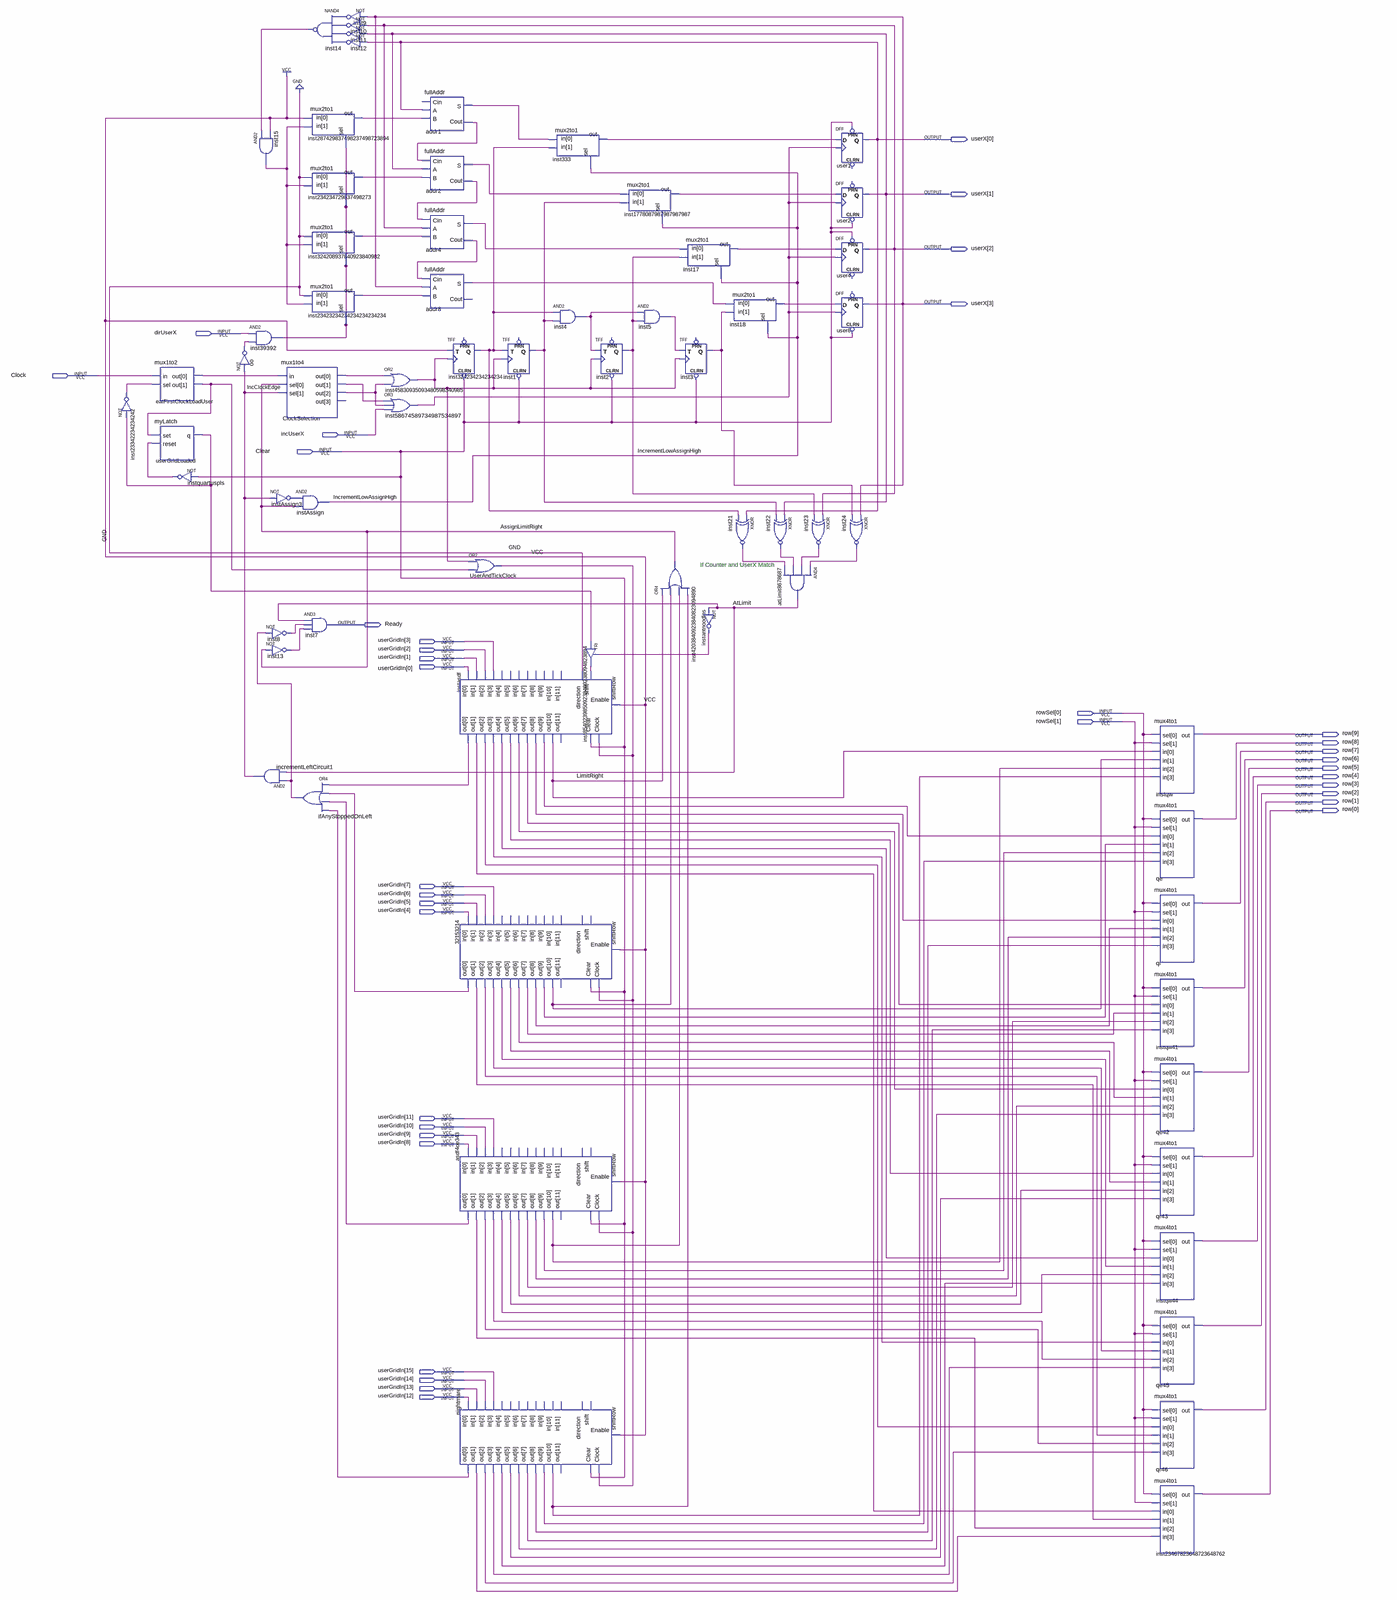
[diagram p0: schematic sheet, whole]
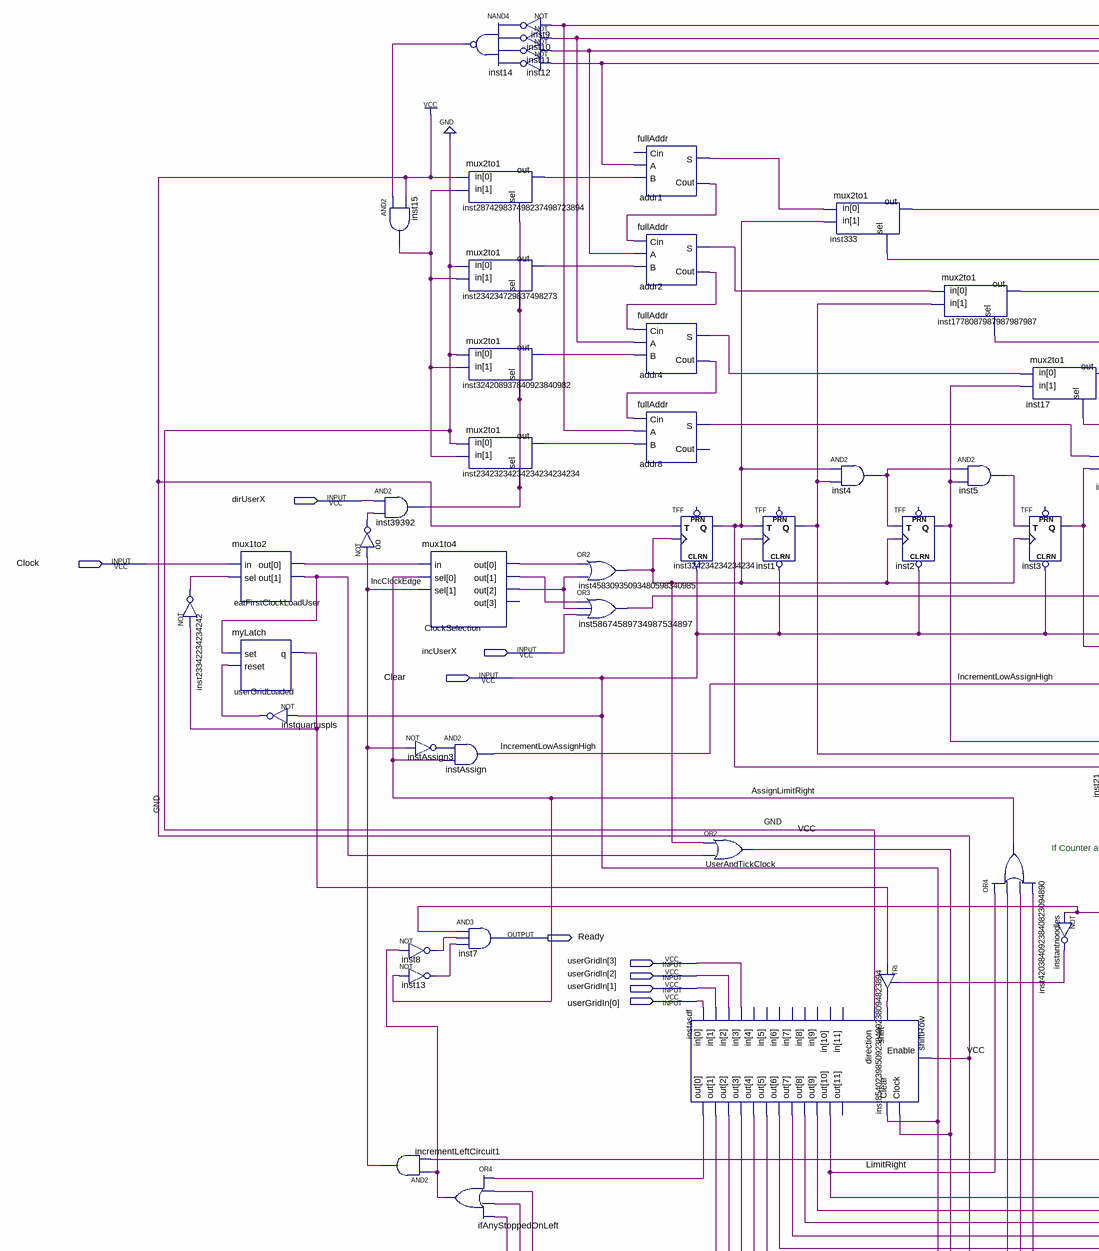
[diagram p1: schematic sheet, upper left part]
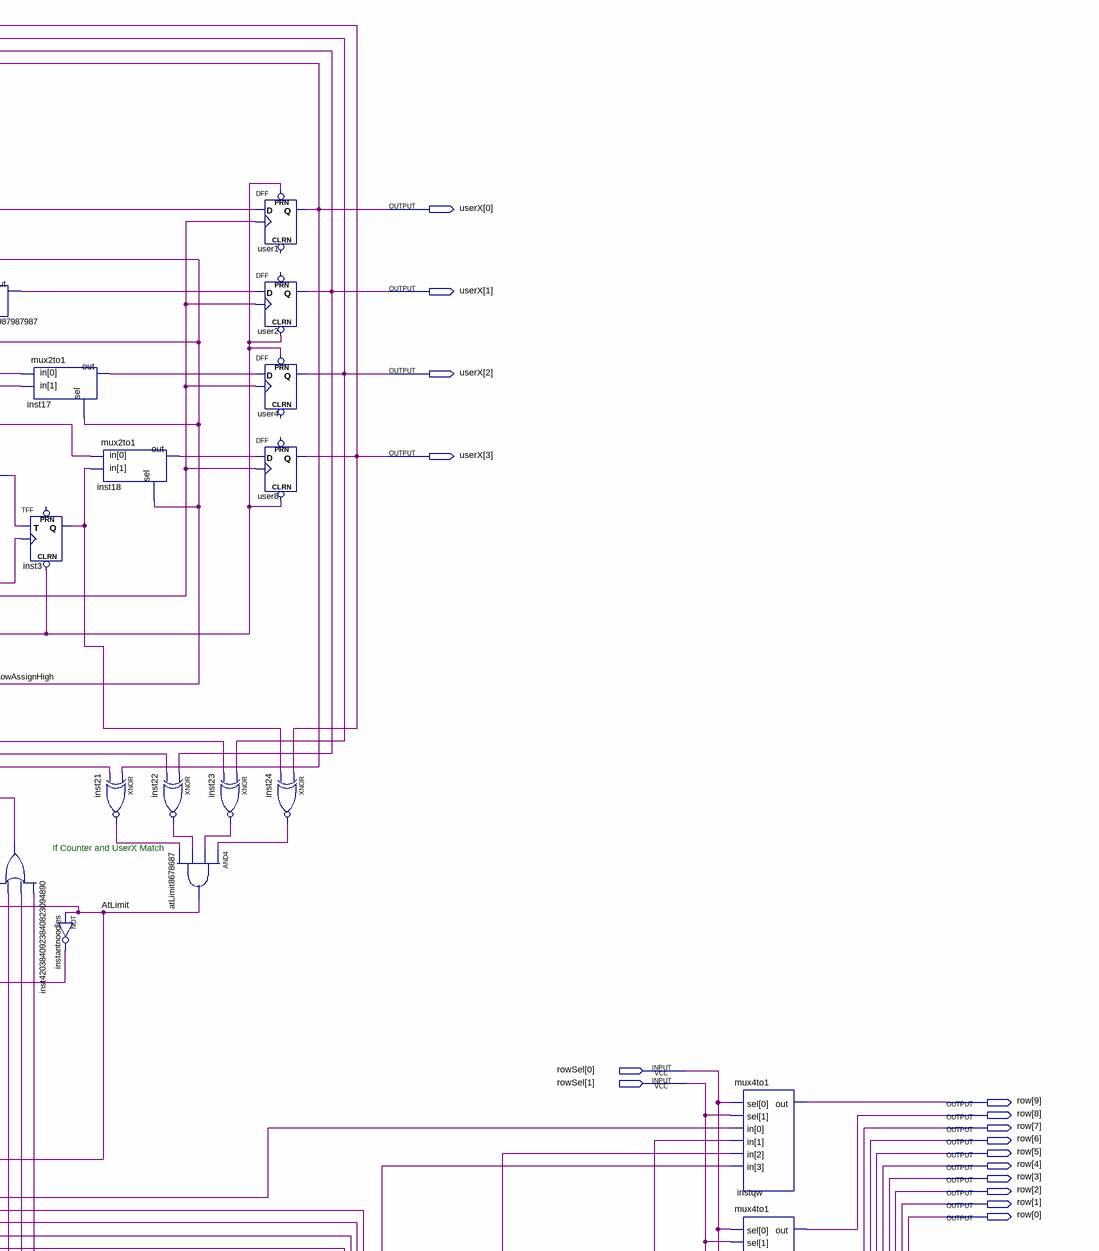
[diagram p2: schematic sheet, upper right part]
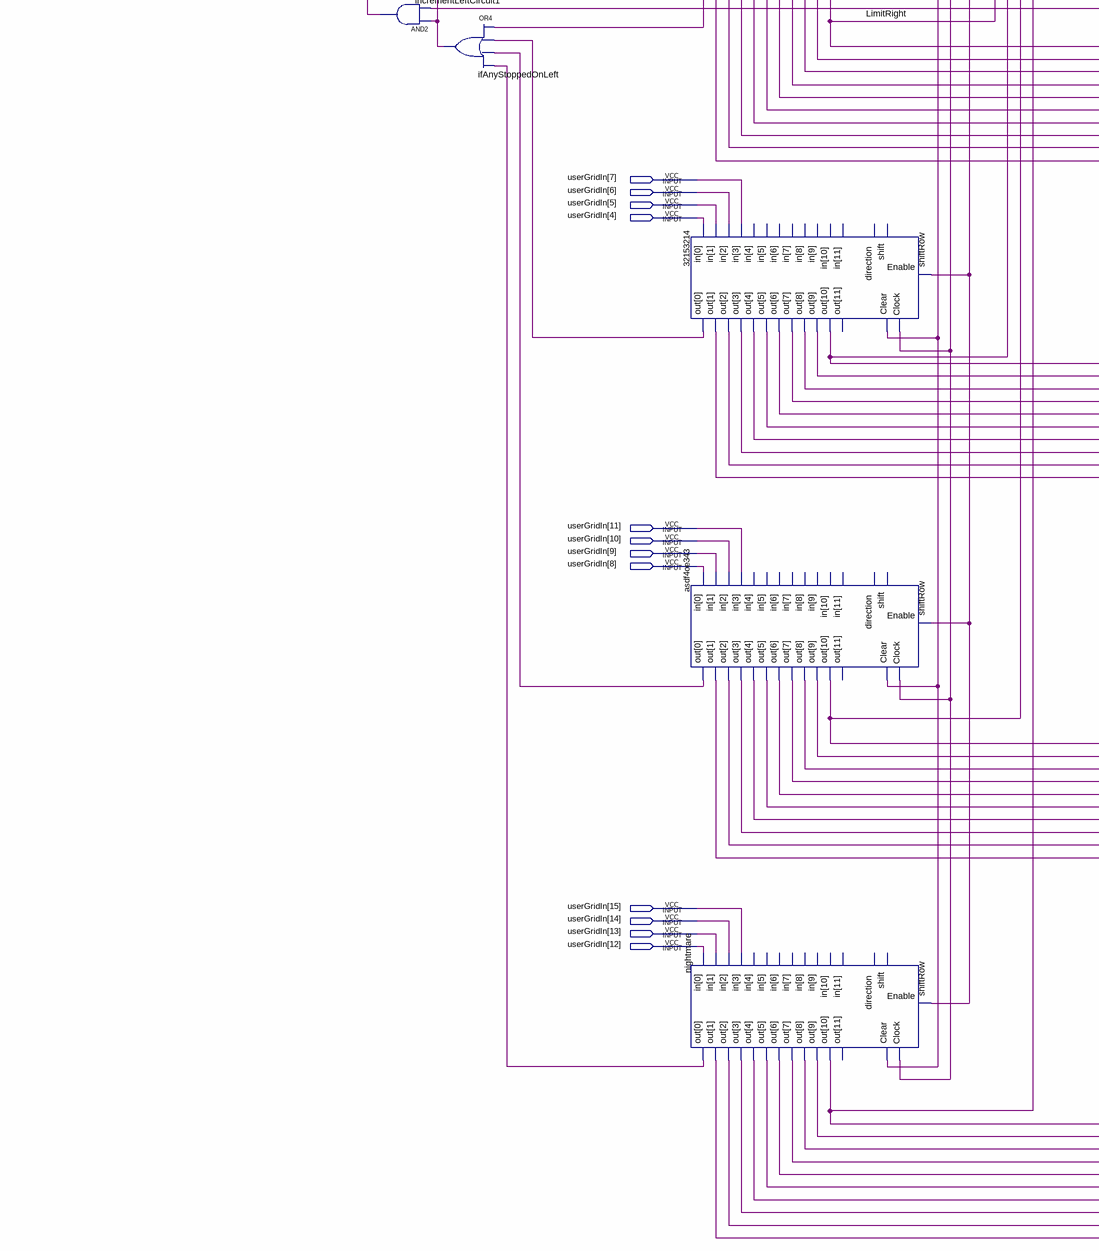
[diagram p3: schematic sheet, lower left part]
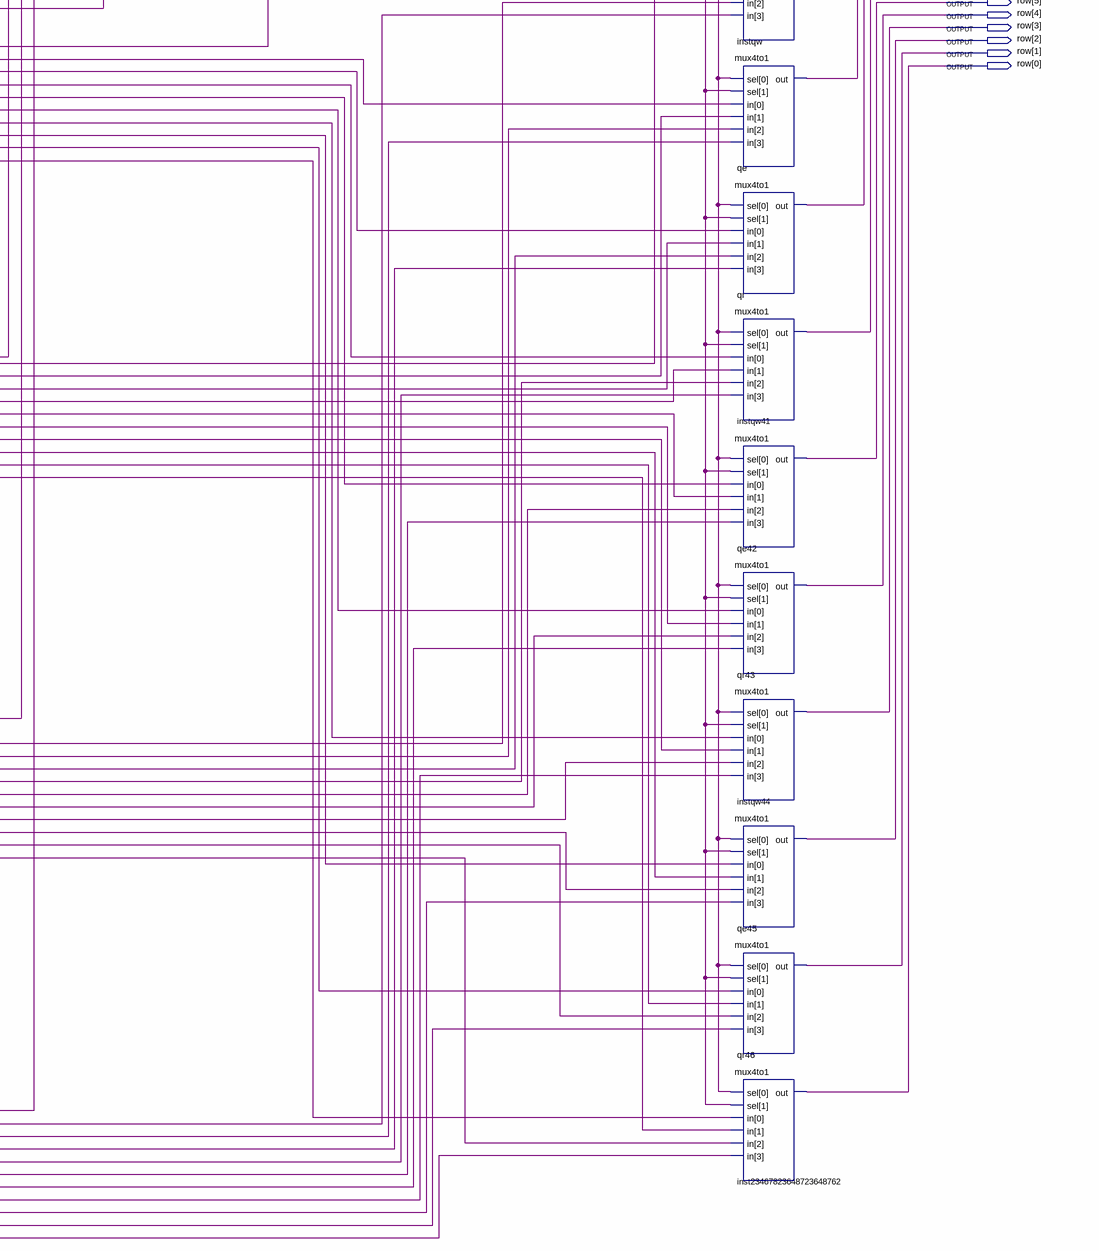
[diagram p4: schematic sheet, lower right part]
// Quartus schematic userX.bdf as structural Verilog: 67 symbols, 37 pins
module userX (
  input  dirUserX,
  input  Clock,
  input  incUserX,
  input  Clear,
  input  [15:0] userGridIn,
  input  [1:0] rowSel,
  output [3:0] userX,
  output Ready,
  output [9:0] row
);

  wire addr1_cout, addr1_s, addr2_cout, addr2_s, addr4_cout, addr4_s, addr8_s, asdf4oe343_out,
       asdf4oe343_out_2, asdf4oe343_out_3, asdf4oe343_out_4, asdf4oe343_out_5, asdf4oe343_out_6,
       asdf4oe343_out_7, asdf4oe343_out_8, asdf4oe343_out_9, asdf4oe343_out_10, asdf4oe343_out_11,
       AssignLimitRight, AtLimit, ClockSelection_out, ClockSelection_out_2, ClockSelection_out_3,
       eatFirstClockLoadUser_out, eatFirstClockLoadUser_out_2, ifAnyStoppedOnLeft_out, IncClockEdge,
       IncrementLowAssignHigh, inst1_q, inst2_q, inst3_q, inst4_out, inst5_out, inst8_out, inst9_out,
       inst10_out, inst11_out, inst12_out, inst13_out, inst14_out, inst15_out, inst17_out, inst18_out,
       inst21_out, inst22_out, inst23_out, inst24_out, inst333_out, inst39392_out, inst23342234234242_out,
       inst324234234234234_q, inst234234729837498273_out, inst1778087987987987987_out,
       inst58674589734987534897_out, inst324208937840923840982_out, inst23423234234234234234234_out,
       inst45830935093480598340985_out, inst287429837498237498723894_out,
       inst85402398509238409238094823894_out, instantnoodles_out, instasdf_out, instasdf_out_2,
       instasdf_out_3, instasdf_out_4, instasdf_out_5, instasdf_out_6, instasdf_out_7, instasdf_out_8,
       instasdf_out_9, instasdf_out_10, instAssign3_out, instquartuspls_out, LimitRight, n32153214_out,
       n32153214_out_2, n32153214_out_3, n32153214_out_4, n32153214_out_5, n32153214_out_6, n32153214_out_7,
       n32153214_out_8, n32153214_out_9, n32153214_out_10, n32153214_out_11, nightmare_out, nightmare_out_2,
       nightmare_out_3, nightmare_out_4, nightmare_out_5, nightmare_out_6, nightmare_out_7, nightmare_out_8,
       nightmare_out_9, nightmare_out_10, nightmare_out_11, oo_out, UserAndTickClock_out, userGridLoaded_q;
  wire [11:0] nightmare_out_open;  // unused outputs
  wire [11:0] asdf4oe343_out_open;  // unused outputs
  wire [11:0] u_32153214_out_open;  // unused outputs
  wire [11:0] instasdf_out_open;  // unused outputs
  wire [3:0] ClockSelection_out_open;  // unused outputs

  not inst23342234234242 (inst23342234234242_out, userGridLoaded_q);
  mux1to2 eatFirstClockLoadUser (
    .in(Clock), .sel(inst23342234234242_out), .out({eatFirstClockLoadUser_out, eatFirstClockLoadUser_out_2}));
  myLatch userGridLoaded (.set(eatFirstClockLoadUser_out), .reset(instquartuspls_out), .q(userGridLoaded_q));
  not instquartuspls (instquartuspls_out, Clear);
  not oo (oo_out, IncClockEdge);
  and inst15 (inst15_out, inst14_out, 1'b1);
  and inst39392 (inst39392_out, dirUserX, oo_out);
  mux1to4 ClockSelection (
    .in(eatFirstClockLoadUser_out_2), .sel({IncClockEdge, AssignLimitRight}),
    .out({ClockSelection_out_open[3], ClockSelection_out_3, ClockSelection_out, ClockSelection_out_2}));
  not instAssign3 (instAssign3_out, IncClockEdge);
  not inst8 (inst8_out, ifAnyStoppedOnLeft_out);
  not inst13 (inst13_out, AssignLimitRight);
  and incrementLeftCircuit1 (IncClockEdge, ifAnyStoppedOnLeft_out, AtLimit);
  nand inst14 (inst14_out, inst9_out, inst10_out, inst11_out, inst12_out);
  mux2to1 inst287429837498237498723894 (
    .in({inst15_out, 1'b1}), .sel(inst39392_out), .out(inst287429837498237498723894_out));
  mux2to1 inst234234729837498273 (.in({inst15_out, 1'b0}), .sel(inst39392_out), .out(inst234234729837498273_out));
  mux2to1 inst324208937840923840982 (.in({inst15_out, 1'b0}), .sel(inst39392_out), .out(inst324208937840923840982_out));
  mux2to1 inst23423234234234234234234 (
    .in({inst15_out, 1'b0}), .sel(inst39392_out), .out(inst23423234234234234234234_out));
  and instAssign (IncrementLowAssignHigh, instAssign3_out, AssignLimitRight);
  and inst7 (Ready, AtLimit, inst8_out, inst13_out);
  or ifAnyStoppedOnLeft (ifAnyStoppedOnLeft_out, instasdf_out_4, n32153214_out, asdf4oe343_out, nightmare_out);
  not inst9 (inst9_out, userX[3]);
  not inst10 (inst10_out, userX[2]);
  not inst11 (inst11_out, userX[1]);
  not inst12 (inst12_out, userX[0]);
  or inst45830935093480598340985 (inst45830935093480598340985_out, ClockSelection_out_2, ClockSelection_out_3);
  or inst58674589734987534897 (inst58674589734987534897_out, ClockSelection_out, ClockSelection_out_3, incUserX);
  fullAddr addr1 (.A(userX[0]), .B(inst287429837498237498723894_out), .Cout(addr1_cout), .S(addr1_s));  // open: Cin
  fullAddr addr2 (.A(userX[1]), .B(inst234234729837498273_out), .Cin(addr1_cout), .Cout(addr2_cout), .S(addr2_s));
  fullAddr addr4 (.A(userX[2]), .B(inst324208937840923840982_out), .Cin(addr2_cout), .Cout(addr4_cout), .S(addr4_s));
  fullAddr addr8 (.A(userX[3]), .B(inst23423234234234234234234_out), .Cin(addr4_cout), .S(addr8_s));  // open: Cout
  TFF inst324234234234234 (
    .CLRN(Clear), .T(1'b1), .CLK(inst45830935093480598340985_out), .Q(inst324234234234234_q));  // open: PRN
  or UserAndTickClock (UserAndTickClock_out, inst45830935093480598340985_out, eatFirstClockLoadUser_out);
  shiftRow instasdf (
    .in({{8{1'bz}}, userGridIn[3:0]}), .Enable(1'b1), .Clock(UserAndTickClock_out), .Clear(Clear),
    .shift(inst85402398509238409238094823894_out), .direction(1'b0),
    .out({instasdf_out_open[11], LimitRight, instasdf_out, instasdf_out_5, instasdf_out_2, instasdf_out_3, instasdf_out_6, instasdf_out_7, instasdf_out_10, instasdf_out_8, instasdf_out_9, instasdf_out_4}));
  shiftRow u_32153214 (
    .in({{8{1'bz}}, userGridIn[7:4]}), .Enable(1'b1), .Clock(UserAndTickClock_out), .Clear(Clear),
    .out({u_32153214_out_open[11], n32153214_out_8, n32153214_out_2, n32153214_out_3, n32153214_out_4, n32153214_out_5, n32153214_out_6, n32153214_out_7, n32153214_out_9, n32153214_out_10, n32153214_out_11, n32153214_out}));  // open: shift, direction
  shiftRow asdf4oe343 (
    .in({{8{1'bz}}, userGridIn[11:8]}), .Enable(1'b1), .Clock(UserAndTickClock_out), .Clear(Clear),
    .out({asdf4oe343_out_open[11], asdf4oe343_out_2, asdf4oe343_out_3, asdf4oe343_out_4, asdf4oe343_out_11, asdf4oe343_out_5, asdf4oe343_out_6, asdf4oe343_out_7, asdf4oe343_out_8, asdf4oe343_out_9, asdf4oe343_out_10, asdf4oe343_out}));  // open: shift, direction
  shiftRow nightmare (
    .in({{8{1'bz}}, userGridIn[15:12]}), .Enable(1'b1), .Clock(UserAndTickClock_out), .Clear(Clear),
    .out({nightmare_out_open[11], nightmare_out_3, nightmare_out_2, nightmare_out_4, nightmare_out_11, nightmare_out_5, nightmare_out_6, nightmare_out_10, nightmare_out_7, nightmare_out_8, nightmare_out_9, nightmare_out}));  // open: shift, direction
  TFF inst1 (.CLRN(Clear), .T(inst324234234234234_q), .CLK(inst45830935093480598340985_out), .Q(inst1_q));  // open: PRN
  mux2to1 inst333 (.in({inst324234234234234_q, addr1_s}), .sel(IncrementLowAssignHigh), .out(inst333_out));
  and inst4 (inst4_out, inst324234234234234_q, inst1_q);
  TRI inst85402398509238409238094823894 (
    .IN(userGridLoaded_q), .OE(instantnoodles_out), .OUT(inst85402398509238409238094823894_out));
  TFF inst2 (.CLRN(Clear), .T(inst4_out), .CLK(inst45830935093480598340985_out), .Q(inst2_q));  // open: PRN
  mux2to1 inst1778087987987987987 (
    .in({inst1_q, addr2_s}), .sel(IncrementLowAssignHigh), .out(inst1778087987987987987_out));
  and inst5 (inst5_out, inst4_out, inst2_q);
  mux2to1 inst17 (.in({inst2_q, addr4_s}), .sel(IncrementLowAssignHigh), .out(inst17_out));
  TFF inst3 (.CLRN(Clear), .T(inst5_out), .CLK(inst45830935093480598340985_out), .Q(inst3_q));  // open: PRN
  or inst4203840923840823094890 (AssignLimitRight, LimitRight, n32153214_out_8, asdf4oe343_out_2, nightmare_out_3);
  not instantnoodles (instantnoodles_out, AtLimit);
  mux2to1 inst18 (.in({inst3_q, addr8_s}), .sel(IncrementLowAssignHigh), .out(inst18_out));
  xnor inst21 (inst21_out, userX[0], inst324234234234234_q);
  xnor inst22 (inst22_out, userX[1], inst1_q);
  and atLimit8678687 (AtLimit, inst24_out, inst23_out, inst22_out, inst21_out);
  xnor inst23 (inst23_out, userX[2], inst2_q);
  DFF user1 (.CLK(inst58674589734987534897_out), .D(inst333_out), .PRN(Clear), .Q(userX[0]));  // open: CLRN
  DFF user2 (
    .CLRN(Clear), .CLK(inst58674589734987534897_out), .D(inst1778087987987987987_out), .Q(userX[1]));  // open: PRN
  DFF user4 (.CLK(inst58674589734987534897_out), .D(inst17_out), .PRN(Clear), .Q(userX[2]));  // open: CLRN
  DFF user8 (.CLRN(Clear), .CLK(inst58674589734987534897_out), .D(inst18_out), .Q(userX[3]));  // open: PRN
  xnor inst24 (inst24_out, userX[3], inst3_q);
  mux4to1 instqw (.sel(rowSel), .in({nightmare_out_3, asdf4oe343_out_2, n32153214_out_8, LimitRight}), .out(row[9]));
  mux4to1 qe (.sel(rowSel), .in({nightmare_out_2, asdf4oe343_out_3, n32153214_out_2, instasdf_out}), .out(row[8]));
  mux4to1 qr (.sel(rowSel), .in({nightmare_out_4, asdf4oe343_out_4, n32153214_out_3, instasdf_out_5}), .out(row[7]));
  mux4to1 instqw41 (
    .sel(rowSel), .in({nightmare_out_11, asdf4oe343_out_11, n32153214_out_4, instasdf_out_2}), .out(row[6]));
  mux4to1 qe42 (.sel(rowSel), .in({nightmare_out_5, asdf4oe343_out_5, n32153214_out_5, instasdf_out_3}), .out(row[5]));
  mux4to1 qr43 (.sel(rowSel), .in({nightmare_out_6, asdf4oe343_out_6, n32153214_out_6, instasdf_out_6}), .out(row[4]));
  mux4to1 instqw44 (
    .sel(rowSel), .in({nightmare_out_10, asdf4oe343_out_7, n32153214_out_7, instasdf_out_7}), .out(row[3]));
  mux4to1 qe45 (.sel(rowSel), .in({nightmare_out_7, asdf4oe343_out_8, n32153214_out_9, instasdf_out_10}), .out(row[2]));
  mux4to1 qr46 (.sel(rowSel), .in({nightmare_out_8, asdf4oe343_out_9, n32153214_out_10, instasdf_out_8}), .out(row[1]));
  mux4to1 inst23467823648723648762 (
    .sel(rowSel), .in({nightmare_out_9, asdf4oe343_out_10, n32153214_out_11, instasdf_out_9}), .out(row[0]));

  // Notes on the sheet:
  //   If Counter and UserX Match
endmodule
